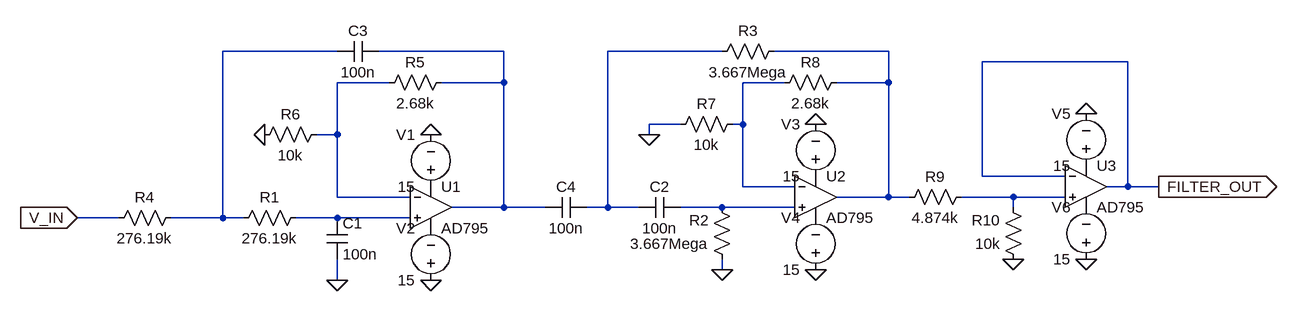
[diagram p0: schematic SO_BESSEL_BPF.asc]
SO_BESSEL_BPF.asc, the LTspice schematic file:
Version 4.1
SHEET 1 1612 680
WIRE 48 -80 -128 -80
WIRE 304 -80 112 -80
WIRE 640 -80 464 -80
WIRE 896 -80 720 -80
WIRE 1264 -64 1040 -64
WIRE 128 -32 48 -32
WIRE 304 -32 304 -80
WIRE 304 -32 208 -32
WIRE 736 -32 672 -32
WIRE 896 -32 896 -80
WIRE 896 -32 816 -32
WIRE 576 32 528 32
WIRE 672 32 672 -32
WIRE 672 32 656 32
WIRE 48 48 48 -32
WIRE 48 48 16 48
WIRE 528 48 528 32
WIRE 1040 112 1040 -64
WIRE 1168 112 1040 112
WIRE 672 128 672 32
WIRE 752 128 672 128
WIRE 1264 128 1264 -64
WIRE 1264 128 1232 128
WIRE 1312 128 1264 128
WIRE 48 144 48 48
WIRE 160 144 48 144
WIRE 896 144 896 -32
WIRE 896 144 816 144
WIRE 928 144 896 144
WIRE 1088 144 1008 144
WIRE 1168 144 1088 144
WIRE 304 160 304 -32
WIRE 304 160 224 160
WIRE 368 160 304 160
WIRE 464 160 464 -80
WIRE 464 160 432 160
WIRE 512 160 464 160
WIRE 640 160 576 160
WIRE 752 160 640 160
WIRE 1088 160 1088 144
WIRE -288 176 -352 176
WIRE -128 176 -128 -80
WIRE -128 176 -208 176
WIRE -96 176 -128 176
WIRE 48 176 -16 176
WIRE 160 176 48 176
WIRE 640 256 640 240
WIRE 48 272 48 240
FLAG 48 272 0
FLAG -352 176 V_IN
IOPIN -352 176 In
FLAG 192 48 0
FLAG 192 272 0
FLAG 640 256 0
FLAG 784 32 0
FLAG 784 256 0
FLAG 1312 128 FILTER_OUT
IOPIN 1312 128 Out
FLAG 528 48 0
FLAG -64 48 0
FLAG 1200 16 0
FLAG 1200 240 0
FLAG 1088 240 0
SYMBOL OpAmps\\AD795 192 96 R0
SYMATTR InstName U1
SYMBOL cap 32 176 R0
SYMATTR InstName C1
SYMATTR Value 100n
SYMBOL res 0 160 R90
WINDOW 0 0 56 VBottom 2
WINDOW 3 32 56 VTop 2
SYMATTR InstName R1
SYMATTR Value 276.19k
SYMBOL voltage 192 144 R180
WINDOW 0 24 96 Left 2
WINDOW 3 24 16 Left 2
WINDOW 123 0 0 Left 0
WINDOW 39 0 0 Left 0
SYMATTR InstName V1
SYMATTR Value 15
SYMBOL voltage 192 288 R180
WINDOW 0 24 96 Left 2
WINDOW 3 24 16 Left 2
WINDOW 123 0 0 Left 0
WINDOW 39 0 0 Left 0
SYMATTR InstName V2
SYMATTR Value 15
SYMBOL OpAmps\\AD795 784 80 R0
SYMATTR InstName U2
SYMBOL voltage 784 128 R180
WINDOW 0 24 96 Left 2
WINDOW 3 24 16 Left 2
WINDOW 123 0 0 Left 0
WINDOW 39 0 0 Left 0
SYMATTR InstName V3
SYMATTR Value 15
SYMBOL voltage 784 272 R180
WINDOW 0 24 96 Left 2
WINDOW 3 24 16 Left 2
WINDOW 123 0 0 Left 0
WINDOW 39 0 0 Left 0
SYMATTR InstName V4
SYMATTR Value 15
SYMBOL res 656 256 R180
WINDOW 0 36 76 Left 2
WINDOW 3 36 40 Left 2
SYMATTR InstName R2
SYMATTR Value 3.667Mega
SYMBOL cap 576 144 R90
WINDOW 0 0 32 VBottom 2
WINDOW 3 32 32 VTop 2
SYMATTR InstName C2
SYMATTR Value 100n
SYMBOL cap 112 -96 R90
WINDOW 0 0 32 VBottom 2
WINDOW 3 32 32 VTop 2
SYMATTR InstName C3
SYMATTR Value 100n
SYMBOL cap 432 144 R90
WINDOW 0 0 32 VBottom 2
WINDOW 3 32 32 VTop 2
SYMATTR InstName C4
SYMATTR Value 100n
SYMBOL res 736 -96 R90
WINDOW 0 0 56 VBottom 2
WINDOW 3 32 56 VTop 2
SYMATTR InstName R3
SYMATTR Value 3.667Mega
SYMBOL res -192 160 R90
WINDOW 0 0 56 VBottom 2
WINDOW 3 32 56 VTop 2
SYMATTR InstName R4
SYMATTR Value 276.19k
SYMBOL res 224 -48 R90
WINDOW 0 0 56 VBottom 2
WINDOW 3 32 56 VTop 2
SYMATTR InstName R5
SYMATTR Value 2.68k
SYMBOL res 32 32 R90
WINDOW 0 0 56 VBottom 2
WINDOW 3 32 56 VTop 2
SYMATTR InstName R6
SYMATTR Value 10k
SYMBOL res 672 16 R90
WINDOW 0 0 56 VBottom 2
WINDOW 3 32 56 VTop 2
SYMATTR InstName R7
SYMATTR Value 10k
SYMBOL res 832 -48 R90
WINDOW 0 0 56 VBottom 2
WINDOW 3 32 56 VTop 2
SYMATTR InstName R8
SYMATTR Value 2.68k
SYMBOL OpAmps\\AD795 1200 64 R0
SYMATTR InstName U3
SYMBOL voltage 1200 112 R180
WINDOW 0 24 96 Left 2
WINDOW 3 24 16 Left 2
WINDOW 123 0 0 Left 0
WINDOW 39 0 0 Left 0
SYMATTR InstName V5
SYMATTR Value 15
SYMBOL voltage 1200 256 R180
WINDOW 0 24 96 Left 2
WINDOW 3 24 16 Left 2
WINDOW 123 0 0 Left 0
WINDOW 39 0 0 Left 0
SYMATTR InstName V6
SYMATTR Value 15
SYMBOL res 1024 128 R90
WINDOW 0 0 56 VBottom 2
WINDOW 3 32 56 VTop 2
SYMATTR InstName R9
SYMATTR Value 4.874k
SYMBOL res 1104 256 R180
WINDOW 0 36 76 Left 2
WINDOW 3 36 40 Left 2
SYMATTR InstName R10
SYMATTR Value 10k

The netlist it stands for:
* SO_BESSEL_BPF.asc
X§U1 N009 N005 P001 P002 N002 AD795  ; pins In+ In- V+ V- OUT
C1 N009 0 100n
R1 N009 N001 276.19k
V1 P001 0 15
V2 0 P002 15
X§U2 N008 N006 P003 P004 N004 AD795  ; pins In+ In- V+ V- OUT
V3 P003 0 15
V4 0 P004 15
R2 0 N008 3.667Mega
C2 N008 N003 100n
C3 N002 N001 100n
C4 N003 N002 100n
R3 N004 N003 3.667Mega
R4 N001 V_IN 276.19k
R5 N002 N005 2.68k
R6 N005 0 10k
R7 N006 0 10k
R8 N004 N006 2.68k
X§U3 N007 FILTER_OUT P005 P006 FILTER_OUT AD795  ; pins In+ In- V+ V- OUT
V5 P005 0 15
V6 0 P006 15
R9 N007 N004 4.874k
R10 0 N007 10k
.lib ADI1.lib
.backanno
.end